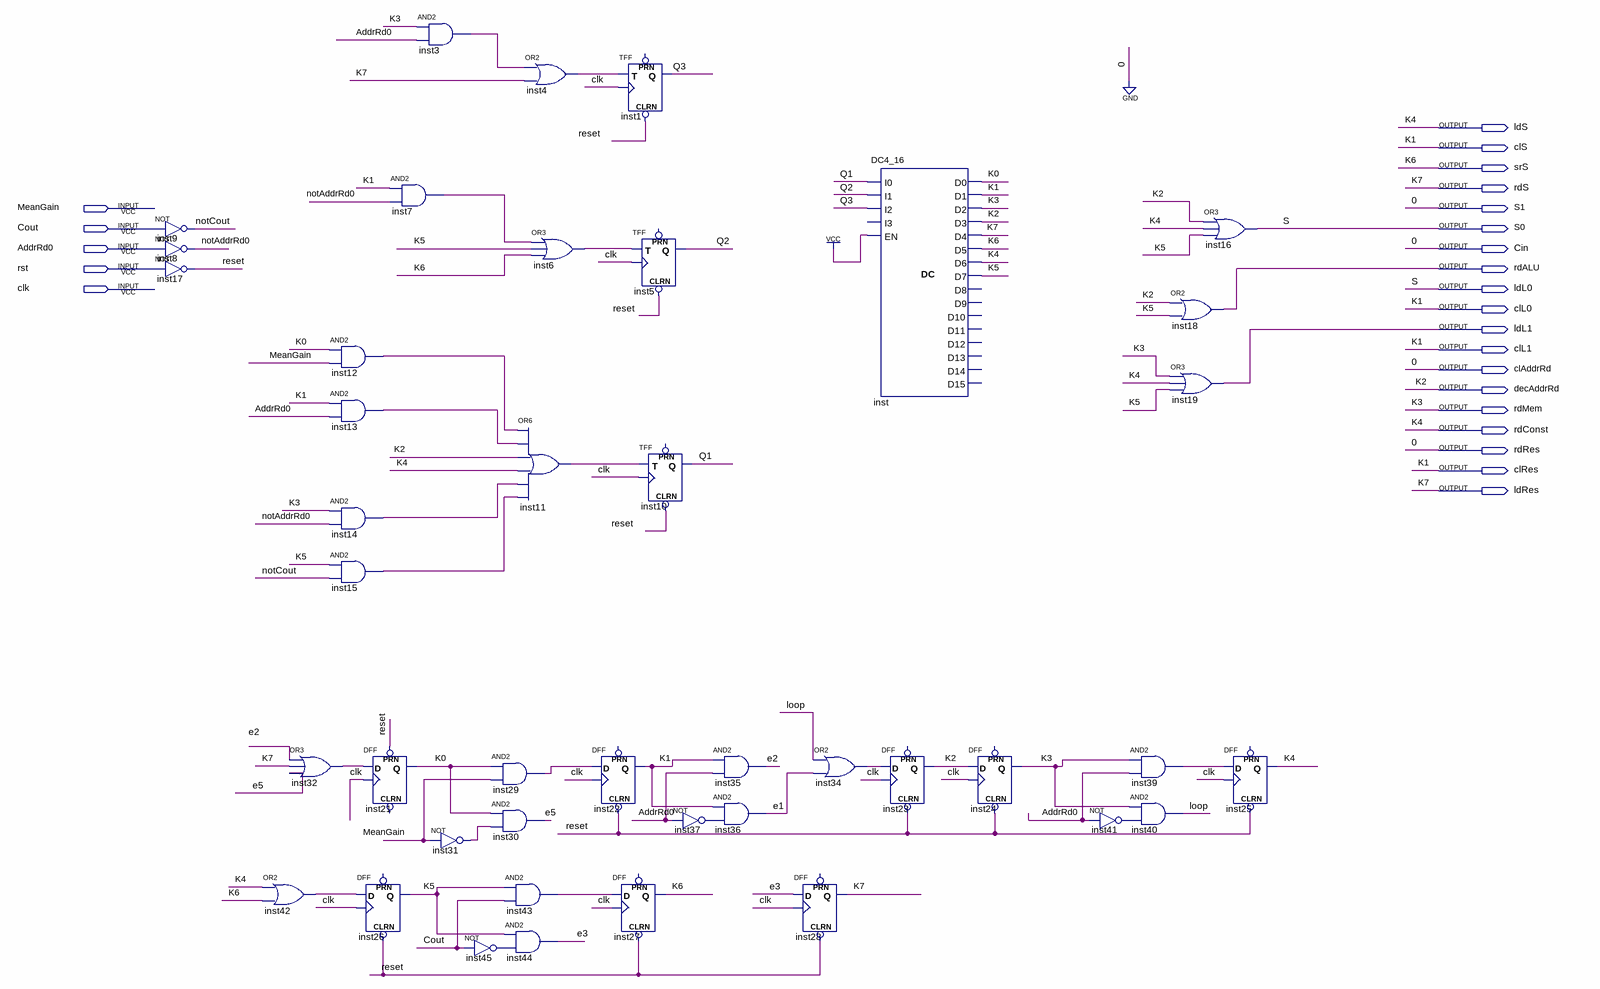
[diagram p0: schematic sheet]
// Quartus schematic backup.bdf as structural Verilog: 42 symbols, 24 pins
module backup (
  input  MeanGain,
  input  Cout,
  input  AddrRd0,
  input  rst,
  input  clk,
  output ldS,
  output clS,
  output srS,
  output rdS,
  output S1,
  output S0,
  output Cin,
  output rdALU,
  output ldL0,
  output clL0,
  output ldL1,
  output clL1,
  output clAddrRd,
  output decAddrRd,
  output rdMem,
  output rdConst,
  output rdRes,
  output clRes,
  output ldRes
);

  wire e1, e2, e3, e5, inst3_out, inst4_out, inst6_out, inst7_out, inst11_out, inst12_out, inst13_out,
       inst14_out, inst15_out, inst29_out, inst31_out, inst32_out, inst34_out, inst37_out, inst39_out,
       inst41_out, inst42_out, inst43_out, inst45_out, K0, K5, loop, notAddrRd0, notCout, Q1, Q2, Q3, reset;

  not inst9 (notCout, Cout);
  not inst8 (notAddrRd0, AddrRd0);
  not inst17 (reset, rst);
  or inst42 (inst42_out, ldS, srS);
  and inst12 (inst12_out, K0, MeanGain);
  and inst13 (inst13_out, clL0, AddrRd0);
  and inst14 (inst14_out, rdMem, notAddrRd0);
  and inst15 (inst15_out, K5, notCout);
  or inst32 (inst32_out, e2, ldRes, e5);
  and inst7 (inst7_out, clL0, notAddrRd0);
  DFF inst21 (.CLK(clk), .D(inst32_out), .PRN(reset), .Q(K0));  // open: CLRN
  DFF inst26 (.CLRN(reset), .CLK(clk), .D(inst42_out), .Q(K5));  // open: PRN
  and inst3 (inst3_out, rdMem, AddrRd0);
  not inst31 (inst31_out, MeanGain);
  and inst29 (inst29_out, K0, MeanGain);
  and inst30 (e5, K0, inst31_out);
  not inst45 (inst45_out, Cout);
  or inst4 (inst4_out, inst3_out, ldRes);
  or inst6 (inst6_out, inst7_out, K5, srS);
  or inst11 (inst11_out, inst12_out, inst13_out, decAddrRd, ldS, inst14_out, inst15_out);
  and inst43 (inst43_out, K5, Cout);
  and inst44 (e3, K5, inst45_out);
  DFF inst22 (.CLRN(reset), .CLK(clk), .D(inst29_out), .Q(clL0));  // open: PRN
  TFF inst1 (.CLRN(reset), .T(inst4_out), .CLK(clk), .Q(Q3));  // open: PRN
  TFF inst5 (.CLRN(reset), .T(inst6_out), .CLK(clk), .Q(Q2));  // open: PRN
  TFF inst10 (.CLRN(reset), .T(inst11_out), .CLK(clk), .Q(Q1));  // open: PRN
  DFF inst27 (.CLRN(reset), .CLK(clk), .D(inst43_out), .Q(srS));  // open: PRN
  and inst35 (e2, clL0, AddrRd0);
  and inst36 (e1, clL0, inst37_out);
  not inst37 (inst37_out, AddrRd0);
  or inst34 (inst34_out, loop, e1);
  DFF inst28 (.CLRN(reset), .CLK(clk), .D(e3), .Q(ldRes));  // open: PRN
  DC4_16 inst (
    .I0(Q1), .I1(Q2), .I2(Q3), .EN(1'b1), .D0(K0), .D1(clL0), .D2(rdMem), .D3(decAddrRd), .D4(ldRes),
    .D5(srS), .D6(ldS), .D7(K5));  // open: I3, D8, D9, D10, D11, D12, D13, D14, D15
  DFF inst23 (.CLRN(reset), .CLK(clk), .D(inst34_out), .Q(decAddrRd));  // open: PRN
  DFF inst24 (.CLRN(reset), .CLK(clk), .D(decAddrRd), .Q(rdMem));  // open: PRN
  not inst41 (inst41_out, AddrRd0);
  and inst39 (inst39_out, rdMem, AddrRd0);
  and inst40 (loop, rdMem, inst41_out);
  or inst18 (rdALU, decAddrRd, K5);
  or inst19 (ldL1, rdMem, ldS, K5);
  or inst16 (ldL0, decAddrRd, ldS, K5);
  DFF inst25 (.CLRN(reset), .CLK(clk), .D(inst39_out), .Q(ldS));  // open: PRN

  assign Cin = 1'b0;
  assign clAddrRd = 1'b0;
  assign clL1 = clL0;
  assign clRes = clL0;
  assign clS = clL0;
  assign rdConst = ldS;
  assign rdRes = 1'b0;
  assign rdS = ldRes;
  assign S0 = ldL0;
  assign S1 = 1'b0;

  // Other names for the same wires on the sheet: K1 = clL0; K2 = decAddrRd; K3 = rdMem; K4 = ldS; K6 = srS;
  //   K7 = ldRes; S = ldL0
endmodule
